# Altium schematic sheet mcu_atmega.SchDoc: Microcontroller unit
size A3
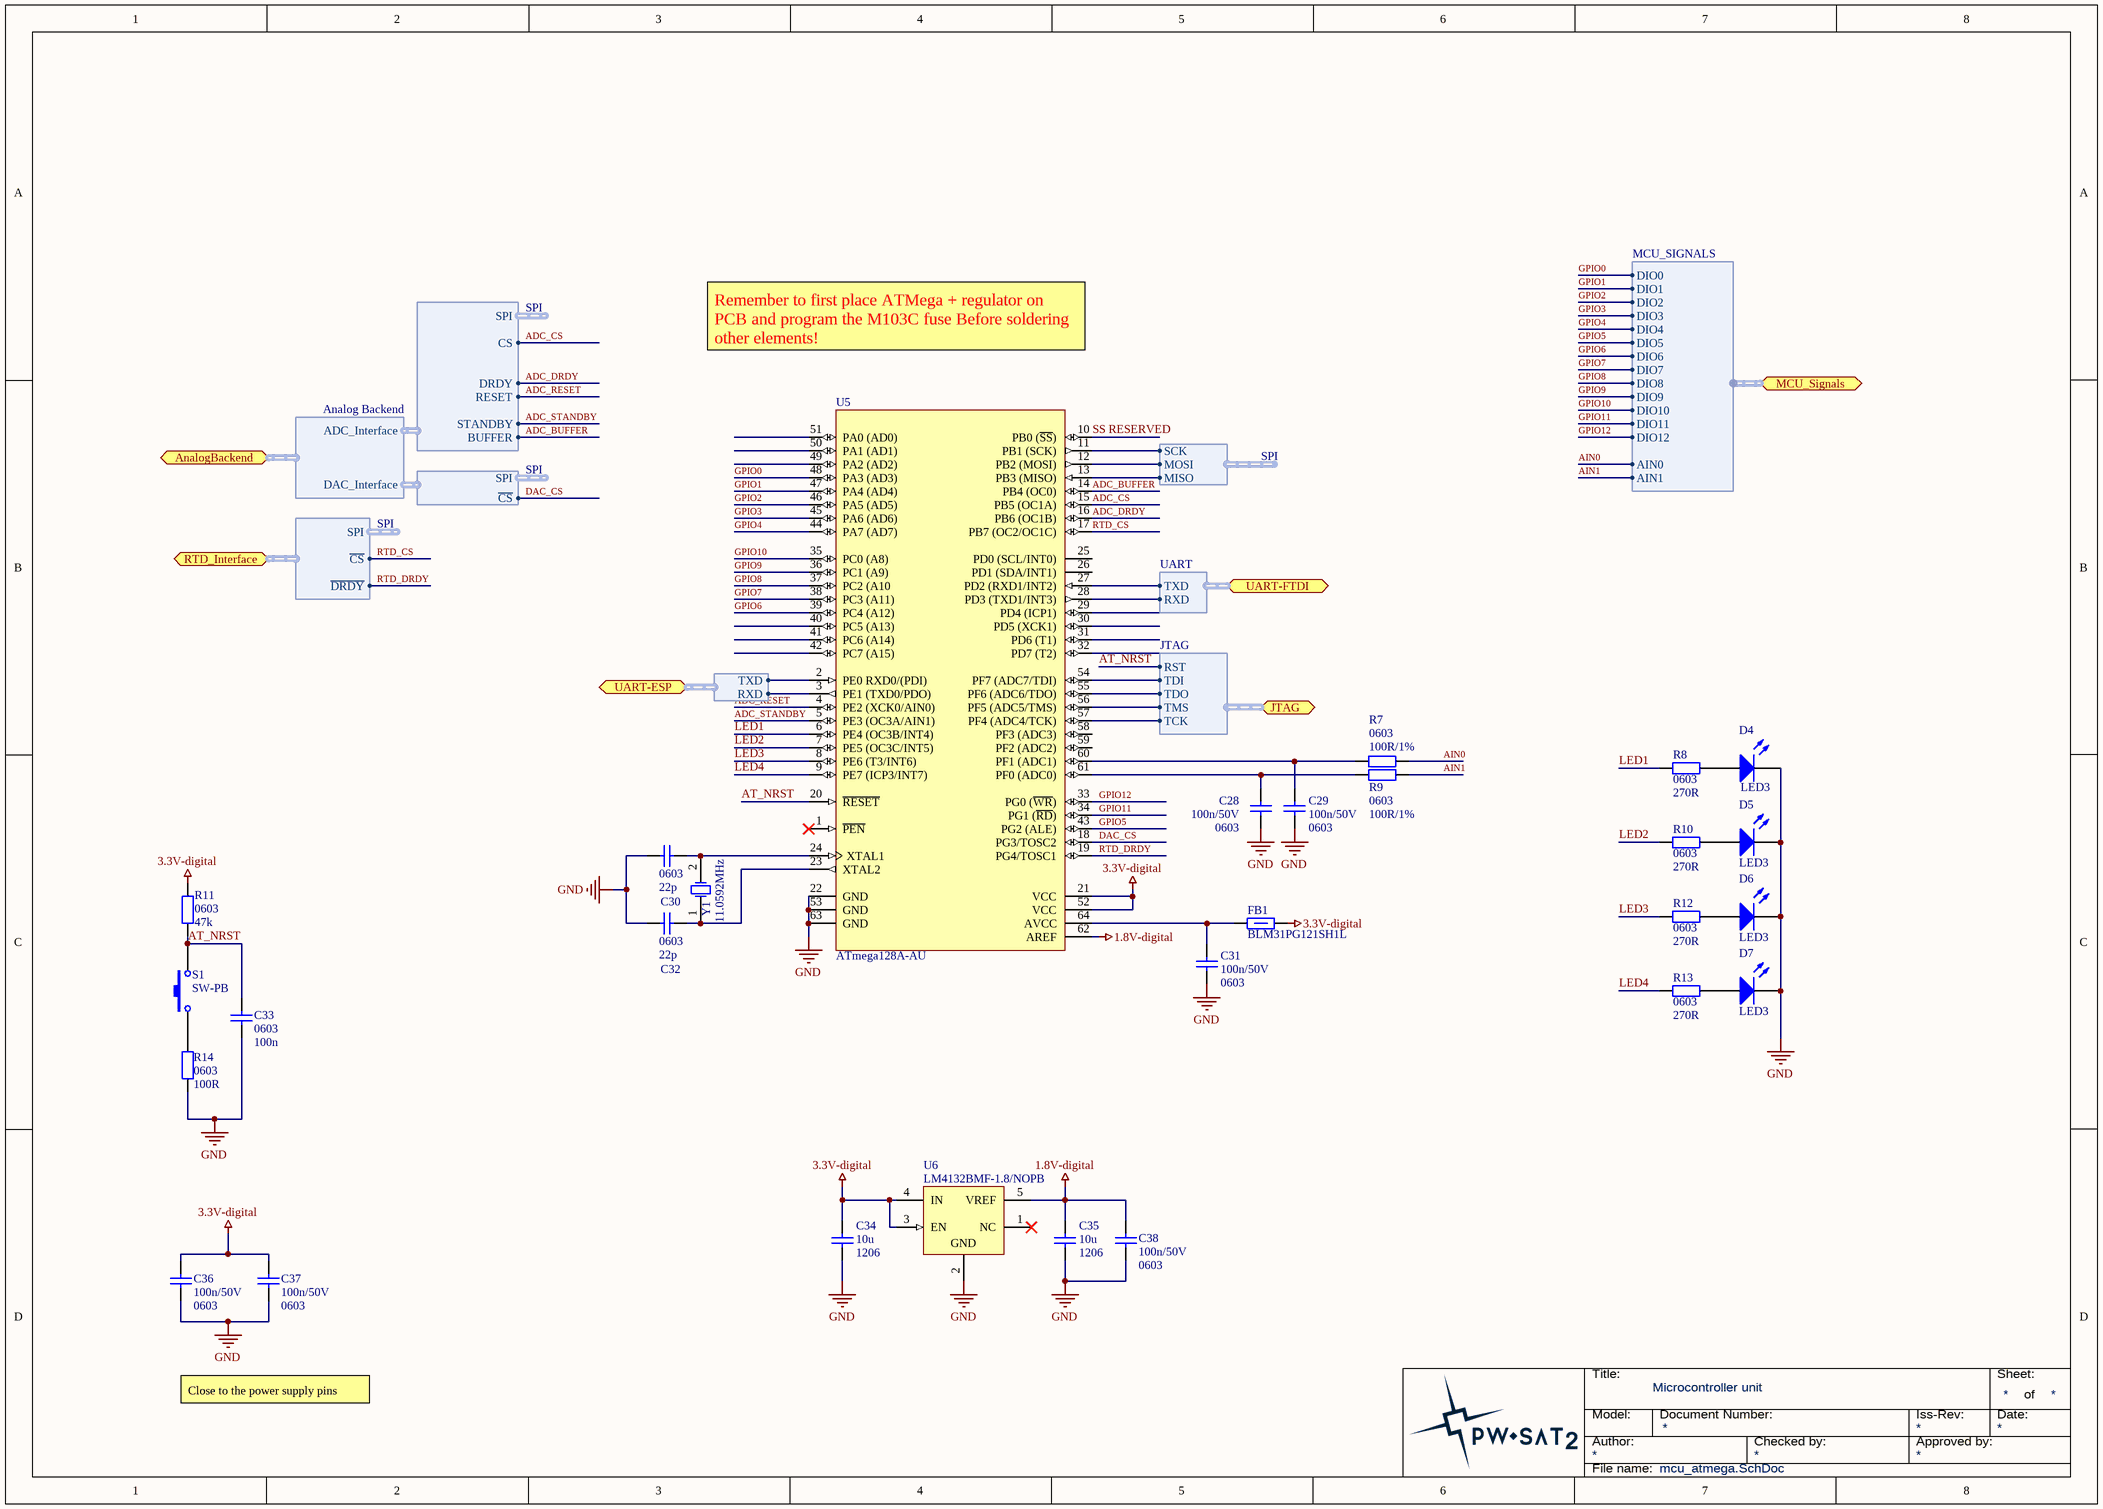
[diagram p0: mcu_atmega.SchDoc]

## Parts
C28  Package: 0603  [SMD_Capacitor_0603]  (hidden comment: 100n/50V)
C29  Package: 0603  [SMD_Capacitor_0603]  (hidden comment: 100n/50V)
C30  0603  value 22p  [SMD_Capacitor_0603]
C31  Package: 0603  [SMD_Capacitor_0603]  (hidden comment: 100n/50V)
C32  0603  value 22p  [SMD_Capacitor_0603]
C33  0603  value 100n  [SMD_Capacitor_0603]
C34  value 10u  Package: 1206  [SMD_Capacitor_1206]  (hidden comment: Cap)
C35  value 10u  Package: 1206  [SMD_Capacitor_1206]  (hidden comment: Cap)
C36  Package: 0603  [SMD_Capacitor_0603]  (hidden comment: 100n/50V)
C37  Package: 0603  [SMD_Capacitor_0603]  (hidden comment: 100n/50V)
C38  Package: 0603  [SMD_Capacitor_0603]  (hidden comment: 100n/50V)
D4  LED3  [LED 0805 Blue]
D5  LED3  [LED 0805 Yellow]
D6  LED3  [LED 0805 GREEN]
D7  LED3  [LED 0805 RED]
FB1  120R/100MHz  [SMD_FerriteBead_1206]  (value not drawn)
R7  Package: 0603  [SMD_Resistor_0603]  (hidden comment: 100R/1%)
R8  0603  value 270R  [SMD_Resistor_0603]
R9  Package: 0603  [SMD_Resistor_0603]  (hidden comment: 100R/1%)
R10  0603  value 270R  [SMD_Resistor_0603]
R11  0603  value 47k  [SMD_Resistor_0603]
R12  0603  value 270R  [SMD_Resistor_0603]
R13  0603  value 270R  [SMD_Resistor_0603]
R14  0603  value 100R  [SMD_Resistor_0603]
S1  SW-PB  [Tact Switch 3x6]
U5  ATmega128A-AU  [64A_M]
U6  LM4132BMF-1.8/NOPB  [MF05A_N]
Y1  11.0592MHz  [CRYSTAL_HC49-US-SM]

## Ports
AnalogBackend (harness Analog Backend), JTAG (harness JTAG), MCU_Signals (harness MCU_SIGNALS), RTD_Interface (harness RTD_DIGITAL), UART-ESP (harness UART), UART-FTDI (harness UART)

## Harnesses
JTAG: TCK, TMS, TDO, TDI, RST
SPI: SCK, MOSI, MISO
UART: RXD, TXD
UART: TXD, RXD
Analog Backend: ADC_Interface, DAC_Interface
ADC_DIGITAL: DRDY, RESET, STANDBY, BUFFER, CS, SPI
DAC_DIGITAL: SPI, ~{CS}
RTD_DIGITAL: SPI, ~{CS}, ~{DRDY}
MCU_SIGNALS: DIO0, AIN0, AIN1, DIO1, DIO2, DIO3, DIO4, DIO5, DIO6, DIO7, DIO8, DIO9, DIO10, DIO11, DIO12

## Nets
1.8V-digital: C35.1 C38.1 U5.62(AREF) U6.5(VREF)
3.3V-digital: C34.1 C36.1 C37.1 FB1.1 R11.2 U5.21(VCC) U5.52(VCC) U6.3(EN) U6.4(IN)
GND: C28.2 C29.2 C30.1 C31.2 C32.1 C33.1 C34.2 C35.2 C36.2 C37.2 C38.2 D4.2(K) D5.2(K) D6.2(K) D7.2(K) R14.2 U5.22(GND) U5.53(GND) U5.63(GND) U6.2(GND)
ADC_BUFFER: U5.14(PB4_(OC0)) ; harness ADC_DIGITAL.BUFFER
ADC_CS: U5.15(PB5_(OC1A)) ; harness ADC_DIGITAL.CS
ADC_DRDY: U5.16(PB6_(OC1B)) ; harness ADC_DIGITAL.DRDY
ADC_RESET: U5.4(PE2_(XCK0/AIN0)) ; harness ADC_DIGITAL.RESET
ADC_STANDBY: U5.5(PE3_(OC3A/AIN1)) ; harness ADC_DIGITAL.STANDBY
AIN0: R7.1 ; port MCU_Signals.AIN0
AIN1: R9.2 ; port MCU_Signals.AIN1
AT_NRST: C33.2 R11.1 S1.2 U5.20(~{RESET}) ; port JTAG.RST
DAC_CS: U5.18(PG3/TOSC2) ; harness DAC_DIGITAL.~{CS}
GPIO0: U5.48(PA3_(AD3)) ; port MCU_Signals.DIO0
GPIO1: U5.47(PA4_(AD4)) ; port MCU_Signals.DIO1
GPIO2: U5.46(PA5_(AD5)) ; port MCU_Signals.DIO2
GPIO3: U5.45(PA6_(AD6)) ; port MCU_Signals.DIO3
GPIO4: U5.44(PA7_(AD7)) ; port MCU_Signals.DIO4
GPIO5: U5.43(PG2_(ALE)) ; port MCU_Signals.DIO5
GPIO6: U5.39(PC4_(A12)) ; port MCU_Signals.DIO6
GPIO7: U5.38(PC3_(A11)) ; port MCU_Signals.DIO7
GPIO8: U5.37(PC2_(A10) ; port MCU_Signals.DIO8
GPIO9: U5.36(PC1_(A9)) ; port MCU_Signals.DIO9
GPIO10: U5.35(PC0_(A8)) ; port MCU_Signals.DIO10
GPIO11: U5.34(PG1_(~{RD})) ; port MCU_Signals.DIO11
GPIO12: U5.33(PG0_(~{WR})) ; port MCU_Signals.DIO12
LED1: R8.2 U5.6(PE4_(OC3B/INT4))
LED2: R10.2 U5.7(PE5_(OC3C/INT5))
LED3: R12.2 U5.8(PE6_(T3/INT6))
LED4: R13.2 U5.9(PE7_(ICP3/INT7))
RTD_CS: U5.17(PB7_(OC2/OC1C)) ; port RTD_Interface.~{CS}
RTD_DRDY: U5.19(PG4/TOSC1) ; port RTD_Interface.~{DRDY}
SPI.MISO: U5.13(PB3_(MISO)) ; harness SPI.MISO
SPI.MOSI: U5.12(PB2_(MOSI)) ; harness SPI.MOSI
SPI.SCK: U5.11(PB1_(SCK)) ; harness SPI.SCK
SS RESERVED: U5.10(PB0_(~{SS}))
NetC28_1: C28.1 R9.1 U5.61(PF0_(ADC0))
NetC29_1: C29.1 R7.2 U5.60(PF1_(ADC1))
NetC30_2: C30.2 U5.24(XTAL1) Y1.2(OSC2)
NetC31_1: C31.1 FB1.2 U5.64(AVCC)
NetC32_2: C32.2 U5.23(XTAL2) Y1.1(OSC1)
NetD4_1: D4.1(A) R8.1
NetD5_1: D5.1(A) R10.1
NetD6_1: D6.1(A) R12.1
NetD7_1: D7.1(A) R13.1
NetR14_1: R14.1 S1.1
NetU5_2: U5.2(PE0_RXD0/(PDI)) ; port UART-ESP.TXD
NetU5_3: U5.3(PE1_(TXD0/PDO)) ; port UART-ESP.RXD
NetU5_27: U5.27(PD2_(RXD1/INT2)) ; port UART-FTDI.TXD
NetU5_28: U5.28(PD3_(TXD1/INT3)) ; port UART-FTDI.RXD
NetU5_54: U5.54(PF7_(ADC7/TDI)) ; port JTAG.TDI
NetU5_55: U5.55(PF6_(ADC6/TDO)) ; port JTAG.TDO
NetU5_56: U5.56(PF5_(ADC5/TMS)) ; port JTAG.TMS
NetU5_57: U5.57(PF4_(ADC4/TCK)) ; port JTAG.TCK

Not connected (* = marked no-connect by the designer): U5 1(~{PEN})* 25(PD0_(SCL/INT0)) 26(PD1_(SDA/INT1)) 29(PD4_(ICP1)) 30(PD5_(XCK1)) 31(PD6_(T1)) 32(PD7_(T2)) 40(PC5_(A13)) 41(PC6_(A14)) 42(PC7_(A15)) 49(PA2_(AD2)) 50(PA1_(AD1)) 51(PA0_(AD0)) 58(PF3_(ADC3)) 59(PF2_(ADC2)); U6 1(NC)*

## Notes on the sheet
- Remember to first place ATMega + regulator on PCB and program the M103C fuse Before soldering other elements!
- Close to the power supply pins
- Title:
- Sheet:
- of
- Author:
- Model:
- Document Number:
- Checked by:
- Iss-Rev:
- Approved by:
- Date:
- File name:

## Library data of the parts
C28 C29 C31 C36-C38 = Cer_C0603T104K5RALTU: Ceramic Cap Kemet COTS 100n/50V X7R 0603; Manufacturer: Kemet; ManufacturerPartNumber: C0603T104K5RALTU; Value: 100n/50V
C30 C32 = Cap1: Capacitor; Published: 8-Jun-2000; LatestRevisionDate: 17-Jul-2002; LatestRevisionNote: Re-released for DXP Platform.; PackageReference: RAD-0.3; Publisher: Altium Limited; PackageDescription: Radial Cap, Thru-Hole; 2 Leads; 0.3 in Pin Spacing
C33 = Cap: Capacitor; Published: 8-Jun-2000; LatestRevisionDate: 17-Jul-2002; LatestRevisionNote: Re-released for DXP Platform.; PackageReference: RAD-0.3; Publisher: Altium Limited; PackageDescription: Radial Cap, Thru-Hole; 2 Leads; 0.3 in Pin Spacing
D4-D7 = LED3: Typical BLUE SiC LED; Published: 8-Jun-2000; LatestRevisionDate: 17-Dec-2003; LatestRevisionNote: PCB Footprint replaced.; DatasheetVersion: 16-Apr-2002; PackageVersion: 16-Apr-2002; PackageReference: 3.5X2.8X1.9; Publisher: Altium Limited; PackageDescription: SM LED; 2 C-Bend Leads; Body 3.5 x 2.8 x 1.9 mm, inc leads (LxWxH typ)
FB1 = BLM31PG121SH1L: Ferrite bead, 1206, 0.02HM, 3.5A.; Manufacturer: Murata; Current Rating: 3.5A; Series Resistance DC: 0.02R; Package: 1206; Value: 120R/100MHz; ManufacturerPartNumber: BLM31PG121SH1L
R7 R9 = CRCW0603100RFKxxxx: 100R/1% Vishay CRCW 0603 Resistor. 100mW, 100ppm, 75V.; Manufacturer: Vishay; ManufacturerPartNumber: CRCW0603100RFKxxxx; Value: 100R/1%
R8 R10-R14 = Res2: Resistor; Published: 8-Jun-2000; LatestRevisionDate: 17-Jul-2002; LatestRevisionNote: Re-released for DXP Platform.; PackageReference: AXIAL-0.4; Publisher: Altium Limited; PackageDescription: Axial Device, Thru-Hole; 2 Leads; 0.4 in Pin Spacing
S1 = SW-PB: Switch; Published: 24-Mar-1999; LatestRevisionDate: 17-Jul-2002; LatestRevisionNote: Re-released for DXP Platform.; PackageReference: SPST-2; Publisher: Altium Limited; PackageDescription: Switch; 2 Leads
U5 = ATmega128A-AU: 8-bit AVR Microcontroller, 2.7-5.5V, 16MHz, 128KB Flash, 4KB EEPROM, 4KB SRAM, 64-pin TQFP, Industrial Grade (-40°C to 85°C); DatasheetVersion: revH, Feb-2011; PackageVersion: revC, Oct-2010; PackageReference: 64A; PackageDescription: 64-Pin Plastic Thin Profile Quad Flat Pack, 14 x 14 x 1.0 mm Body, 0.8 mm Pitch (TQFP); Code_JEDEC: MS-026-AEB; ComponentLink1Description: Manufacturer URL; ComponentLink1URL: http://www.atmel.com/; ComponentLink2Description: ATmega128A Datasheet; ComponentLink2URL: http://www.atmel.com/dyn/resources/prod_documents/doc8151.pdf; ComponentLink3Description: ATmega128A Summary; ComponentLink3URL: http://www.atmel.com/dyn/resources/prod_documents/8151S.pdf
U6 = LM4132BMF-1.8/NOPB: Precision Low Dropout Voltage Reference, 5-pin SOT-23, Pb-Free; Manufacturer: National Semiconductor; PackageTopMarking: R4AB*XTT; PowerWise: Y; CompType: Voltage Reference IC; DatasheetVersion: Aug-2006; PackageVersion: revD, Aug-2008; PackageReference: MF05A; PackageDescription: Molded SOT-23, .115 x .063 x .040 in Body, 5 Lead, .0375 in Pitch; PartNumber: LM4132BMF-1.8/NOPB; RoHS: Y; PinCount: 5; High-Reliability: Y; ComponentLink1Description: Manufacturer URL; ComponentLink1URL: http://www.national.com/; ComponentLink2Description: LM4132 Datasheet; ComponentLink2URL: http://www.national.com/ds/LM/LM4132.pdf; ComponentLink3Description: LM4132 Web Page; ComponentLink3URL: http://www.national.com/pf/LM/LM4132.html; ComponentLink4Description: MF05A Package Page; ComponentLink4URL: http://www.national.com/packaging/folders/mf05a.html
Y1 = XTAL: LF XTAL003519; Published: 8-Jun-2000; LatestRevisionDate: 17-Jul-2002; LatestRevisionNote: Re-released for DXP Platform.; PackageReference: R38; Publisher: Altium Limited; PackageDescription: Crystal, Thru-Hole; 2 Leads; Body 3.1 x 8.2 mm (Dia.xH)